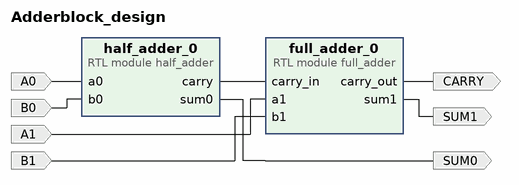
[diagram p0: block diagram of the top level]
# Vivado block design Adderblock_design, xc7a100tcsg324-1, Vivado 2018.2
create_bd_design Adderblock_design

create_bd_port -dir I A0
create_bd_port -dir I B0
create_bd_port -dir O SUM0
create_bd_port -dir I A1
create_bd_port -dir I B1
create_bd_port -dir O SUM1
create_bd_port -dir O CARRY

create_bd_cell -type module -reference half_adder half_adder_0
create_bd_cell -type module -reference full_adder full_adder_0

# ---- connections ----

connect_bd_net -net a0_0_1 [get_bd_ports A0] [get_bd_pins half_adder_0/a0]
connect_bd_net -net b0_0_1 [get_bd_ports B0] [get_bd_pins half_adder_0/b0]
connect_bd_net [get_bd_pins half_adder_0/carry] [get_bd_pins full_adder_0/carry_in]
connect_bd_net [get_bd_pins half_adder_0/sum0] [get_bd_ports SUM0]
connect_bd_net -net a1_0_1 [get_bd_ports A1] [get_bd_pins full_adder_0/a1]
connect_bd_net -net b1_0_1 [get_bd_ports B1] [get_bd_pins full_adder_0/b1]
connect_bd_net [get_bd_pins full_adder_0/sum1] [get_bd_ports SUM1]
connect_bd_net [get_bd_pins full_adder_0/carry_out] [get_bd_ports CARRY]

validate_bd_design
save_bd_design
